# Altium project cnc ver1.PrjPcb
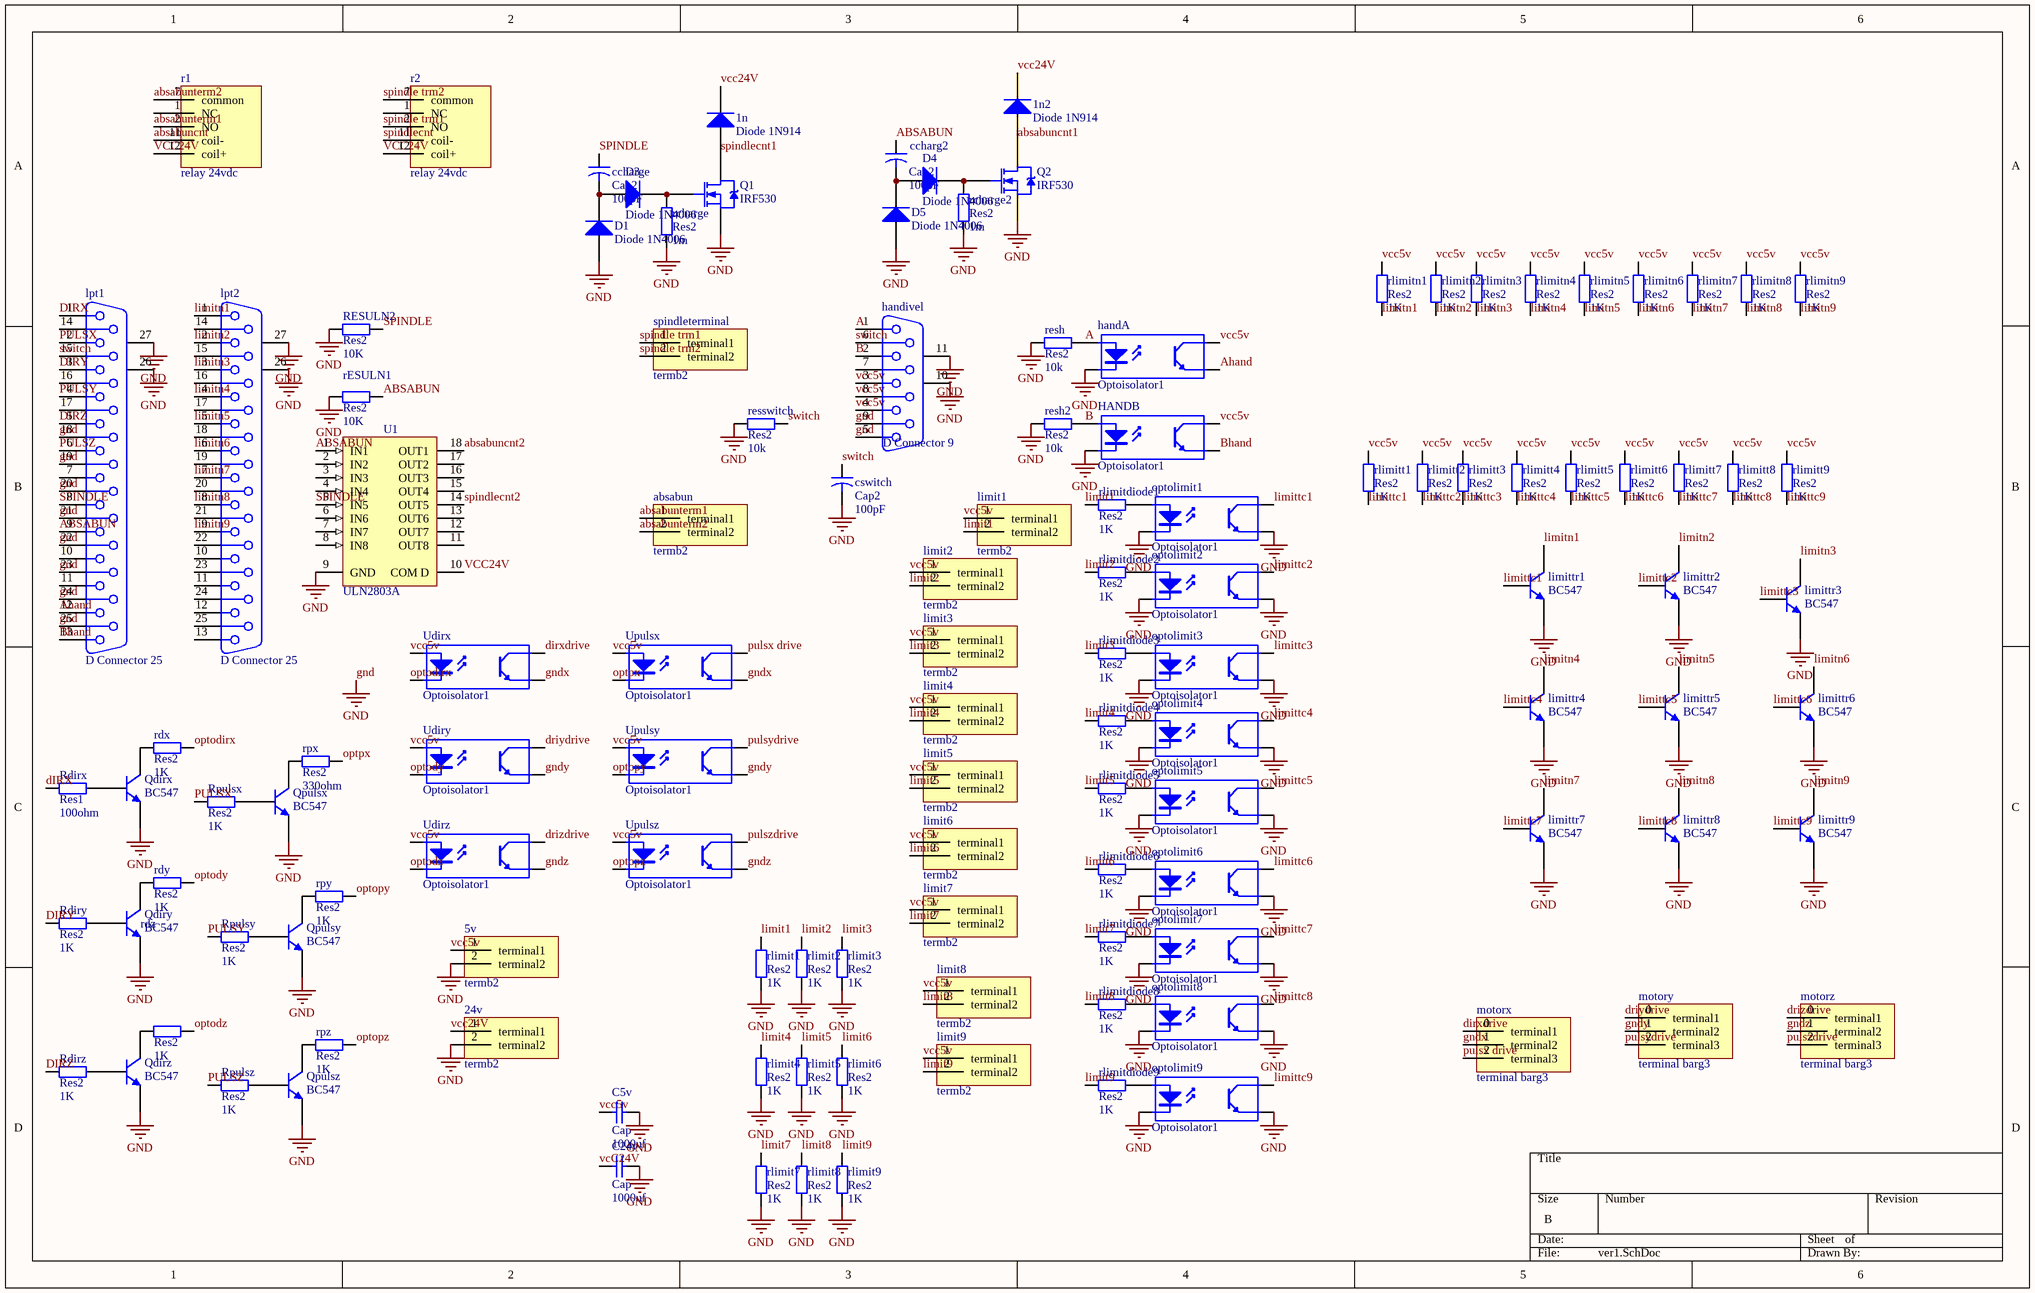
[diagram p0: ver1.SchDoc]
1 sheet, 122 parts. Net scope: global (net labels, ports and power ports of the same name join across sheets).
Board file: ver2.PcbDoc

## Sheet ver1.SchDoc
size B; PageSetup: Record=PageOptions|CenterHorizontal=True|CenterVertical=True|PrintScale=1.00|XCorrection=1.00|YCorrection=1.00|PrintKind=1|BorderSize=5000000|LeftOffset=0|BottomOffset=0|Orientation=2|PaperLength=1000|PaperWidth=1000|Scale=100|PaperSource=7|PrintQuality=-4|MediaType=1|DitherType=10|PrintScaleMode=1|PaperKind=A4|PaperIndex=9

### Parts
1n  Diode 1N914  [DO-35]
1n2  Diode 1N914  [DO-35]
5v  termb2  [PCBComponent_1]
24v  termb2  [PCBComponent_1]
absabun  termb2  [PCBComponent_1]
C5v  Cap  value 1000uf  [RAD-0.3]
C24v  Cap  value 1000uf  [RAD-0.3]
ccharg2  Cap2  value 100pF  [CAPR5-4X5]
ccharge  Cap2  value 100pF  [CAPR5-4X5]
cswitch  Cap2  value 100pF  [CAPR5-4X5]
D1  Diode 1N4006  [DO-41]
D3  Diode 1N4006  [DO-41]
D4  Diode 1N4006  [DO-41]
D5  Diode 1N4006  [DO-41]
handA  Optoisolator1  [DIP-4]
HANDB  Optoisolator1  [DIP-4]
handivel  D Connector 9  [DSUB1.385-2H9]
limit1  termb2  [PCBComponent_1]
limit2  termb2  [PCBComponent_1]
limit3  termb2  [PCBComponent_1]
limit4  termb2  [PCBComponent_1]
limit5  termb2  [PCBComponent_1]
limit6  termb2  [PCBComponent_1]
limit7  termb2  [PCBComponent_1]
limit8  termb2  [PCBComponent_1]
limit9  termb2  [PCBComponent_1]
limittr1  BC547  [SOT54]
limittr2  BC547  [SOT54]
limittr3  BC547  [SOT54]
limittr4  BC547  [SOT54]
limittr5  BC547  [SOT54]
limittr6  BC547  [SOT54]
limittr7  BC547  [SOT54]
limittr8  BC547  [SOT54]
limittr9  BC547  [SOT54]
lpt1  D Connector 25  [DSUB1.385-2H25A]
lpt2  D Connector 25  [DSUB1.385-2H25A]
motorx  terminal barg3  [PCBComponent_1]
motory  terminal barg3  [PCBComponent_1]
motorz  terminal barg3  [PCBComponent_1]
optolimit1  Optoisolator1  [DIP-4]
optolimit2  Optoisolator1  [DIP-4]
optolimit3  Optoisolator1  [DIP-4]
optolimit4  Optoisolator1  [DIP-4]
optolimit5  Optoisolator1  [DIP-4]
optolimit6  Optoisolator1  [DIP-4]
optolimit7  Optoisolator1  [DIP-4]
optolimit8  Optoisolator1  [DIP-4]
optolimit9  Optoisolator1  [DIP-4]
Q1  IRF530  [TO-220AB]
Q2  IRF530  [TO-220AB]
Qdirx  BC547  [SOT54]
Qdiry  BC547  [SOT54]
Qdirz  BC547  [SOT54]
Qpulsx  BC547  [SOT54]
Qpulsy  BC547  [SOT54]
Qpulsz  BC547  [SOT54]
r1  relay 24vdc  [PCBComponent_1]
r2  relay 24vdc  [PCBComponent_1]
rcharge  Res2  value 1m  [AXIAL-0.4]
rcharge2  Res2  value 1m  [AXIAL-0.4]
Rdirx  Res1  value 100ohm  [AXIAL-0.4]
Rdiry  Res2  value 1K  [AXIAL-0.4]
Rdirz  Res2  value 1K  [AXIAL-0.4]
rdx  Res2  value 1K  [AXIAL-0.4]
rdy  Res2  value 1K  [AXIAL-0.4]
rdz  Res2  value 1K  [AXIAL-0.4]
resh  Res2  value 10k  [AXIAL-0.4]
resh2  Res2  value 10k  [AXIAL-0.4]
resswitch  Res2  value 10k  [AXIAL-0.4]
rESULN1  Res2  value 10K  [AXIAL-0.4]
RESULN2  Res2  value 10K  [AXIAL-0.4]
rlimit1  Res2  value 1K  [AXIAL-0.4]
rlimit2  Res2  value 1K  [AXIAL-0.4]
rlimit3  Res2  value 1K  [AXIAL-0.4]
rlimit4  Res2  value 1K  [AXIAL-0.4]
rlimit5  Res2  value 1K  [AXIAL-0.4]
rlimit6  Res2  value 1K  [AXIAL-0.4]
rlimit7  Res2  value 1K  [AXIAL-0.4]
rlimit8  Res2  value 1K  [AXIAL-0.4]
rlimit9  Res2  value 1K  [AXIAL-0.4]
rlimitdiode1  Res2  value 1K  [AXIAL-0.4]
rlimitdiode2  Res2  value 1K  [AXIAL-0.4]
rlimitdiode3  Res2  value 1K  [AXIAL-0.4]
rlimitdiode4  Res2  value 1K  [AXIAL-0.4]
rlimitdiode5  Res2  value 1K  [AXIAL-0.4]
rlimitdiode6  Res2  value 1K  [AXIAL-0.4]
rlimitdiode7  Res2  value 1K  [AXIAL-0.4]
rlimitdiode8  Res2  value 1K  [AXIAL-0.4]
rlimitdiode9  Res2  value 1K  [AXIAL-0.4]
rlimitn1  Res2  value 1K  [AXIAL-0.4]
rlimitn2  Res2  value 1K  [AXIAL-0.4]
rlimitn3  Res2  value 1K  [AXIAL-0.4]
rlimitn4  Res2  value 1K  [AXIAL-0.4]
rlimitn5  Res2  value 1K  [AXIAL-0.4]
rlimitn6  Res2  value 1K  [AXIAL-0.4]
rlimitn7  Res2  value 1K  [AXIAL-0.4]
rlimitn8  Res2  value 1K  [AXIAL-0.4]
rlimitn9  Res2  value 1K  [AXIAL-0.4]
rlimitt1  Res2  value 1K  [AXIAL-0.4]
rlimitt2  Res2  value 1K  [AXIAL-0.4]
rlimitt3  Res2  value 1K  [AXIAL-0.4]
rlimitt4  Res2  value 1K  [AXIAL-0.4]
rlimitt5  Res2  value 1K  [AXIAL-0.4]
rlimitt6  Res2  value 1K  [AXIAL-0.4]
rlimitt7  Res2  value 1K  [AXIAL-0.4]
rlimitt8  Res2  value 1K  [AXIAL-0.4]
rlimitt9  Res2  value 1K  [AXIAL-0.4]
Rpulsx  Res2  value 1K  [AXIAL-0.4]
Rpulsy  Res2  value 1K  [AXIAL-0.4]
Rpulsz  Res2  value 1K  [AXIAL-0.4]
rpx  Res2  value 330ohm  [AXIAL-0.4]
rpy  Res2  value 1K  [AXIAL-0.4]
rpz  Res2  value 1K  [AXIAL-0.4]
spindleterminal  termb2  [PCBComponent_1]
U1  ULN2803A  [A18]
Udirx  Optoisolator1  [DIP-4]
Udiry  Optoisolator1  [DIP-4]
Udirz  Optoisolator1  [DIP-4]
Upulsx  Optoisolator1  [DIP-4]
Upulsy  Optoisolator1  [DIP-4]
Upulsz  Optoisolator1  [DIP-4]

### Nets
gnd: 5v.2(terminal2) 24v.2(terminal2) C5v.2 C24v.2 cswitch.2 D1.1(A) D5.1(A) handA.2(K) HANDB.2(K) handivel.5 handivel.9 handivel.10(MH1) handivel.11(MH2) limittr1.1(E) limittr2.1(E) limittr3.1(E) limittr4.1(E) limittr5.1(E) limittr6.1(E) limittr7.1(E) limittr8.1(E) limittr9.1(E) lpt1.18 lpt1.19 lpt1.20 lpt1.21 lpt1.22 lpt1.23 lpt1.24 lpt1.25 lpt1.26(MH1) lpt1.27(MH2) lpt2.26(MH1) lpt2.27(MH2) optolimit1.2(K) optolimit1.3(E) optolimit2.2(K) optolimit2.3(E) optolimit3.2(K) optolimit3.3(E) optolimit4.2(K) optolimit4.3(E) optolimit5.2(K) optolimit5.3(E) optolimit6.2(K) optolimit6.3(E) optolimit7.2(K) optolimit7.3(E) optolimit8.2(K) optolimit8.3(E) optolimit9.2(K) optolimit9.3(E) Q1.3(S) Q2.3(S) Qdirx.1(E) Qdiry.1(E) Qdirz.1(E) Qpulsx.1(E) Qpulsy.1(E) Qpulsz.1(E) rcharge.1 rcharge2.1 resh.1 resh2.1 resswitch.1 rESULN1.1 RESULN2.1 rlimit1.1 rlimit2.2 rlimit3.2 rlimit4.2 rlimit5.2 rlimit6.2 rlimit7.2 rlimit8.2 rlimit9.2 U1.9(GND)
A: handA.1(A) handivel.1 resh.2
ABSABUN: ccharg2.1 lpt1.9 rESULN1.2 U1.1(IN1)
absabuncnt: r1.11(coil-)
absabuncnt1: 1n2.1(A) Q2.2(D)
absabuncnt2: U1.18(OUT1)
absabunterm1: absabun.1(terminal1) r1.2(NO)
absabunterm2: absabun.2(terminal2) r1.7(common)
Ahand: handA.3(E) lpt1.12
B: HANDB.1(A) handivel.2 resh2.2
Bhand: HANDB.3(E) lpt1.13
DIRX: lpt1.1 Rdirx.1
dirxdrive: motorx.0(terminal1) Udirx.4(C)
DIRY: lpt1.3 Rdiry.1
DIRZ: lpt1.5 Rdirz.1
driydrive: motory.0(terminal1) Udiry.4(C)
drizdrive: motorz.0(terminal1) Udirz.4(C)
gndx: motorx.1(terminal2) Udirx.3(E) Upulsx.3(E)
gndy: motory.1(terminal2) Udiry.3(E) Upulsy.3(E)
gndz: motorz.1(terminal2) Udirz.3(E) Upulsz.3(E)
limit1: limit1.2(terminal2) rlimit1.2 rlimitdiode1.1
limit2: limit2.2(terminal2) rlimit2.1 rlimitdiode2.1
limit3: limit3.2(terminal2) rlimit3.1 rlimitdiode3.1
limit4: limit4.2(terminal2) rlimit4.1 rlimitdiode4.1
limit5: limit5.2(terminal2) rlimit5.1 rlimitdiode5.1
limit6: limit6.2(terminal2) rlimit6.1 rlimitdiode6.1
limit7: limit7.2(terminal2) rlimit7.1 rlimitdiode7.1
limit8: limit8.2(terminal2) rlimit8.1 rlimitdiode8.1
limit9: limit9.2(terminal2) rlimit9.1 rlimitdiode9.1
limitn1: limittr1.3(C) lpt2.1 rlimitn1.1
limitn2: limittr2.3(C) lpt2.2 rlimitn2.1
limitn3: limittr3.3(C) lpt2.3 rlimitn3.1
limitn4: limittr4.3(C) lpt2.4 rlimitn4.1
limitn5: limittr5.3(C) lpt2.5 rlimitn5.1
limitn6: limittr6.3(C) lpt2.6 rlimitn6.1
limitn7: limittr7.3(C) lpt2.7 rlimitn7.1
limitn8: limittr8.3(C) lpt2.8 rlimitn8.1
limitn9: limittr9.3(C) lpt2.9 rlimitn9.1
limittc1: limittr1.2(B) optolimit1.4(C) rlimitt1.1
limittc2: limittr2.2(B) optolimit2.4(C) rlimitt2.1
limittc3: limittr3.2(B) optolimit3.4(C) rlimitt3.1
limittc4: limittr4.2(B) optolimit4.4(C) rlimitt4.1
limittc5: limittr5.2(B) optolimit5.4(C) rlimitt5.1
limittc6: limittr6.2(B) optolimit6.4(C) rlimitt6.1
limittc7: limittr7.2(B) optolimit7.4(C) rlimitt7.1
limittc8: limittr8.2(B) optolimit8.4(C) rlimitt8.1
limittc9: limittr9.2(B) optolimit9.4(C) rlimitt9.1
optodirx: rdx.2 Udirx.2(K)
optody: rdy.2 Udiry.2(K)
optodz: rdz.2 Udirz.2(K)
optopy: rpy.2 Upulsy.2(K)
optopz: rpz.2 Upulsz.2(K)
optpx: rpx.2 Upulsx.2(K)
PULSX: lpt1.2 Rpulsx.1
pulsx drive: motorx.2(terminal3) Upulsx.4(C)
PULSY: lpt1.4 Rpulsy.1
pulsydrive: motory.2(terminal3) Upulsy.4(C)
PULSZ: lpt1.6 Rpulsz.1
pulszdrive: motorz.2(terminal3) Upulsz.4(C)
SPINDLE: ccharge.1 lpt1.8 RESULN2.2 U1.5(IN5)
spindle trm1: r2.2(NO) spindleterminal.1(terminal1)
spindle trm2: r2.7(common) spindleterminal.2(terminal2)
spindlecnt: r2.11(coil-)
spindlecnt1: 1n.1(A) Q1.2(D)
spindlecnt2: U1.14(OUT5)
switch: cswitch.1 handivel.6 lpt1.15 resswitch.2
vcc5v: 5v.1(terminal1) C5v.1 handA.4(C) HANDB.4(C) handivel.3 handivel.4 handivel.8 limit1.1(terminal1) limit2.1(terminal1) limit3.1(terminal1) limit4.1(terminal1) limit5.1(terminal1) limit6.1(terminal1) limit7.1(terminal1) limit8.1(terminal1) limit9.1(terminal1) rlimitn1.2 rlimitn2.2 rlimitn3.2 rlimitn4.2 rlimitn5.2 rlimitn6.2 rlimitn7.2 rlimitn8.2 rlimitn9.2 rlimitt1.2 rlimitt2.2 rlimitt3.2 rlimitt4.2 rlimitt5.2 rlimitt6.2 rlimitt7.2 rlimitt8.2 rlimitt9.2 Udirx.1(A) Udiry.1(A) Udirz.1(A) Upulsx.1(A) Upulsy.1(A) Upulsz.1(A)
VCC24V: 1n.2(K) 1n2.2(K) 24v.1(terminal1) C24v.1 r1.12(coil+) r2.12(coil+) U1.10(COM_D)
Netccharg2_2: ccharg2.2 D4.1(A) D5.2(K)
Netccharge_2: ccharge.2 D1.2(K) D3.1(A)
NetD3_2: D3.2(K) Q1.1(G) rcharge.2
NetD4_2: D4.2(K) Q2.1(G) rcharge2.2
Netoptolimit1_1: optolimit1.1(A) rlimitdiode1.2
Netoptolimit2_1: optolimit2.1(A) rlimitdiode2.2
Netoptolimit3_1: optolimit3.1(A) rlimitdiode3.2
Netoptolimit4_1: optolimit4.1(A) rlimitdiode4.2
Netoptolimit5_1: optolimit5.1(A) rlimitdiode5.2
Netoptolimit6_1: optolimit6.1(A) rlimitdiode6.2
Netoptolimit7_1: optolimit7.1(A) rlimitdiode7.2
Netoptolimit8_1: optolimit8.1(A) rlimitdiode8.2
Netoptolimit9_1: optolimit9.1(A) rlimitdiode9.2
NetQdirx_2: Qdirx.2(B) Rdirx.2
NetQdirx_3: Qdirx.3(C) rdx.1
NetQdiry_2: Qdiry.2(B) Rdiry.2
NetQdiry_3: Qdiry.3(C) rdy.1
NetQdirz_2: Qdirz.2(B) Rdirz.2
NetQdirz_3: Qdirz.3(C) rdz.1
NetQpulsx_2: Qpulsx.2(B) Rpulsx.2
NetQpulsx_3: Qpulsx.3(C) rpx.1
NetQpulsy_2: Qpulsy.2(B) Rpulsy.2
NetQpulsy_3: Qpulsy.3(C) rpy.1
NetQpulsz_2: Qpulsz.2(B) Rpulsz.2
NetQpulsz_3: Qpulsz.3(C) rpz.1

Not connected (* = marked no-connect by the designer): handivel 7; lpt1 7 10 11 14 16 17; lpt2 10 11 12 13 14 15 16 17 18 19 20 21 22 23 24 25; r1 1(NC); r2 1(NC); U1 2(IN2) 3(IN3) 4(IN4) 6(IN6) 7(IN7) 8(IN8) 11(OUT8) 12(OUT7) 13(OUT6) 15(OUT4) 16(OUT3) 17(OUT2)

### Library data of the parts
1n 1n2 = Diode 1N914: High Conductance Fast Diode; Published: 8-Jun-2000; LatestRevisionDate: 17-Jul-2002; LatestRevisionNote: Re-released for DXP Platform.; DatasheetVersion: 1997; PackageReference: DO-35; Publisher: Altium Limited; PackageDescription: Diode, Axial; Body 3.8 x 1.9 mm (LxDia. max), Lead Dia. 0.53 mm (max); Code_JEDEC: DO-204-AH; ComponentLink1Description: Manufacturer Link; ComponentLink1URL: http://www.fairchildsemi.com/; ComponentLink2Description: Datasheet; ComponentLink2URL: http://www.fairchildsemi.com/ds/1N%2F1N4448.pdf
C5v C24v = Cap: Capacitor; Published: 8-Jun-2000; LatestRevisionDate: 17-Jul-2002; LatestRevisionNote: Re-released for DXP Platform.; PackageReference: RAD-0.3; Publisher: Altium Limited; PackageDescription: Radial Cap, Thru-Hole; 2 Leads; 0.3 in Pin Spacing
ccharg2 ccharge cswitch = Cap2: Capacitor; Published: 23-Sep-2002; PackageReference: CAPR5-4X5; Publisher: Altium Limited; PackageDescription: Capacitor; 2 Leads
D1 D3-D5 = Diode 1N4006: 1 Amp General Purpose Rectifier; Published: 8-Jun-2000; LatestRevisionDate: 17-Jul-2002; LatestRevisionNote: Re-released for DXP Platform.; DatasheetVersion: 1998; PackageVersion: Aug-1999; PackageReference: DO-41; Publisher: Altium Limited; PackageDescription: Diode, Axial; Body 5.2 x 2.7 mm (LxDia. max), Lead Dia. 0.86 mm (max); Code_JEDEC: DO-204-AL; ComponentLink1Description: Manufacturer Link; ComponentLink1URL: http://www.fairchildsemi.com/; ComponentLink2Description: Datasheet; ComponentLink2URL: http://www.fairchildsemi.com/ds/1N%2F1N4001.pdf
handA HANDB optolimit1-optolimit9 Udirx Udiry Udirz Upulsx Upulsy Upulsz = Optoisolator1: 4-Pin Phototransistor Optocoupler; Published: 24-Mar-1999; LatestRevisionDate: 04-Mar-2005; LatestRevisionNote: Sch pins 3 & 4 Swapped.; DatasheetVersion: Nov-2003; PackageReference: DIP-4; Publisher: Altium Limited
handivel = D Connector 9: Receptacle Assembly, 9 Position, Right Angle; PackageDocument: O; Positions: 9; Published: 15-Jun-2001; LatestRevisionDate: 17-Jul-2002; LatestRevisionNote: Re-released for DXP Platform.; DatasheetDocument: 1-Sep-1999; PackageReference: 788750; Publisher: Altium Limited; Orientation: Right Angle; Gender: Receptacle
limittr1-limittr9 Qdirx Qdiry Qdirz Qpulsx Qpulsy Qpulsz = BC547: NPN General-purpose Transistor; Published: 17-Sep-2003; LatestRevisionDate: 12-Dec-2006; LatestRevisionNote: Footprint pad sequence fixed.; DatasheetVersion: 15-Apr-1999; PackageVersion: Feb-1997; PackageReference: SOT54; Publisher: Altium Limited; PackageDescription: Plastic Single-Ended Leaded (through hole) package; 3 Leads (TO-92); Code_JEITA: SC-43; Code_JEDEC: TO-92; ComponentLink1Description: Manufacturer Link; ComponentLink1URL: http://www.semiconductors.philips.com/; ComponentLink2Description: Datasheet; ComponentLink2URL: http://www.semiconductors.philips.com/acrobat/datasheets/BC546_547_3.pdf
lpt1 lpt2 = D Connector 25: Receptacle Assembly, 25 Position, Right Angle; PackageDocument: U; Positions: 25; Published: 15-Jun-2001; LatestRevisionDate: 17-Jul-2002; LatestRevisionNote: Re-released for DXP Platform.; DatasheetDocument: 19-Mar-1999; PackageReference: 787202; Publisher: Altium Limited; Orientation: Right Angle; Gender: Receptacle
Q1 Q2 = IRF530: HEXFET N-Channel Power MOSFET; Note: Pin 2 is electrically connected to pin 4.; Published: 8-Jun-2000; LatestRevisionDate: 17-Jul-2002; LatestRevisionNote: Re-released for DXP Platform.; DatasheetVersion: PD-9.307O; PackageVersion: Feb-1997; PackageReference: TO-220AB; Publisher: Altium Limited; PackageDescription: TO, Thru-Hole, Vertical, Heatsink Mounted; 3 In-Line Leads; Pitch 2.54 mm; ComponentLink1Description: Manufacturer Link; ComponentLink1URL: http://www.irf.com/; ComponentLink2Description: Datasheet; ComponentLink2URL: http://www.irf.com/product-info/datasheets/data/irf530.pdf
rcharge rcharge2 Rdirx Rdiry Rdirz rdx rdy rdz resh resh2 resswitch rESULN1 RESULN2 rlimit1-rlimit9 rlimitdiode1-rlimitdiode9 rlimitn1-rlimitn9 rlimitt1-rlimitt9 Rpulsx Rpulsy Rpulsz rpx rpy rpz = Res2: Resistor; Published: 8-Jun-2000; LatestRevisionDate: 17-Jul-2002; LatestRevisionNote: Re-released for DXP Platform.; PackageReference: AXIAL-0.4; Publisher: Altium Limited; PackageDescription: Axial Device, Thru-Hole; 2 Leads; 0.4 in Pin Spacing
U1 = ULN2803A: High-Voltage, High-Current Darlington Array; Published: 13-Oct-2000; LatestRevisionDate: 06-Jun-2005; LatestRevisionNote: Stylized 3D Model Added.; DatasheetVersion: 1999; PackageVersion: 1999; PackageReference: A18; Publisher: Altium Limited; PackageDescription: DIP; 18 Leads; Row Spacing 7.62 mm; Pitch 2.54 mm; ComponentLink1Description: Manufacturer Link; ComponentLink1URL: http://www.allegromicro.com/